# EAGLE board Mainboard (EAGLE 8.7.1), part 1 of 2
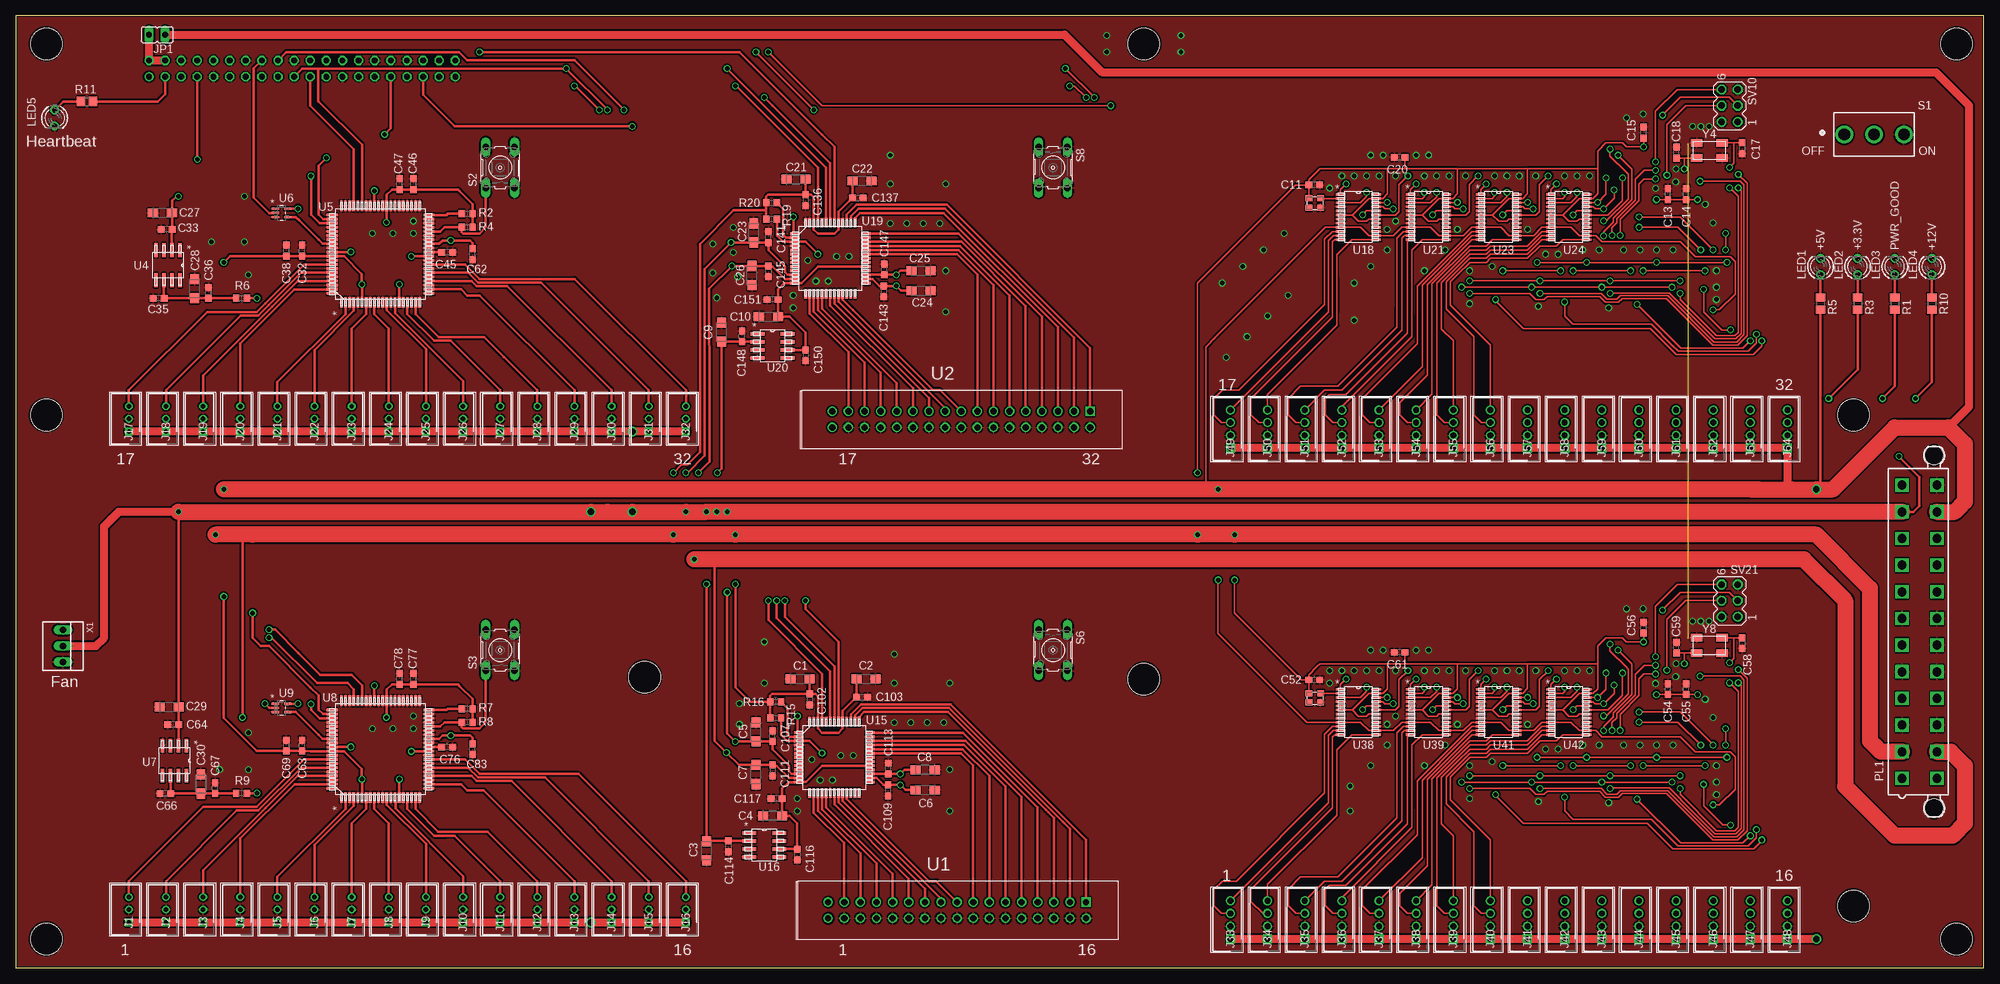
[diagram p11: board, top side]
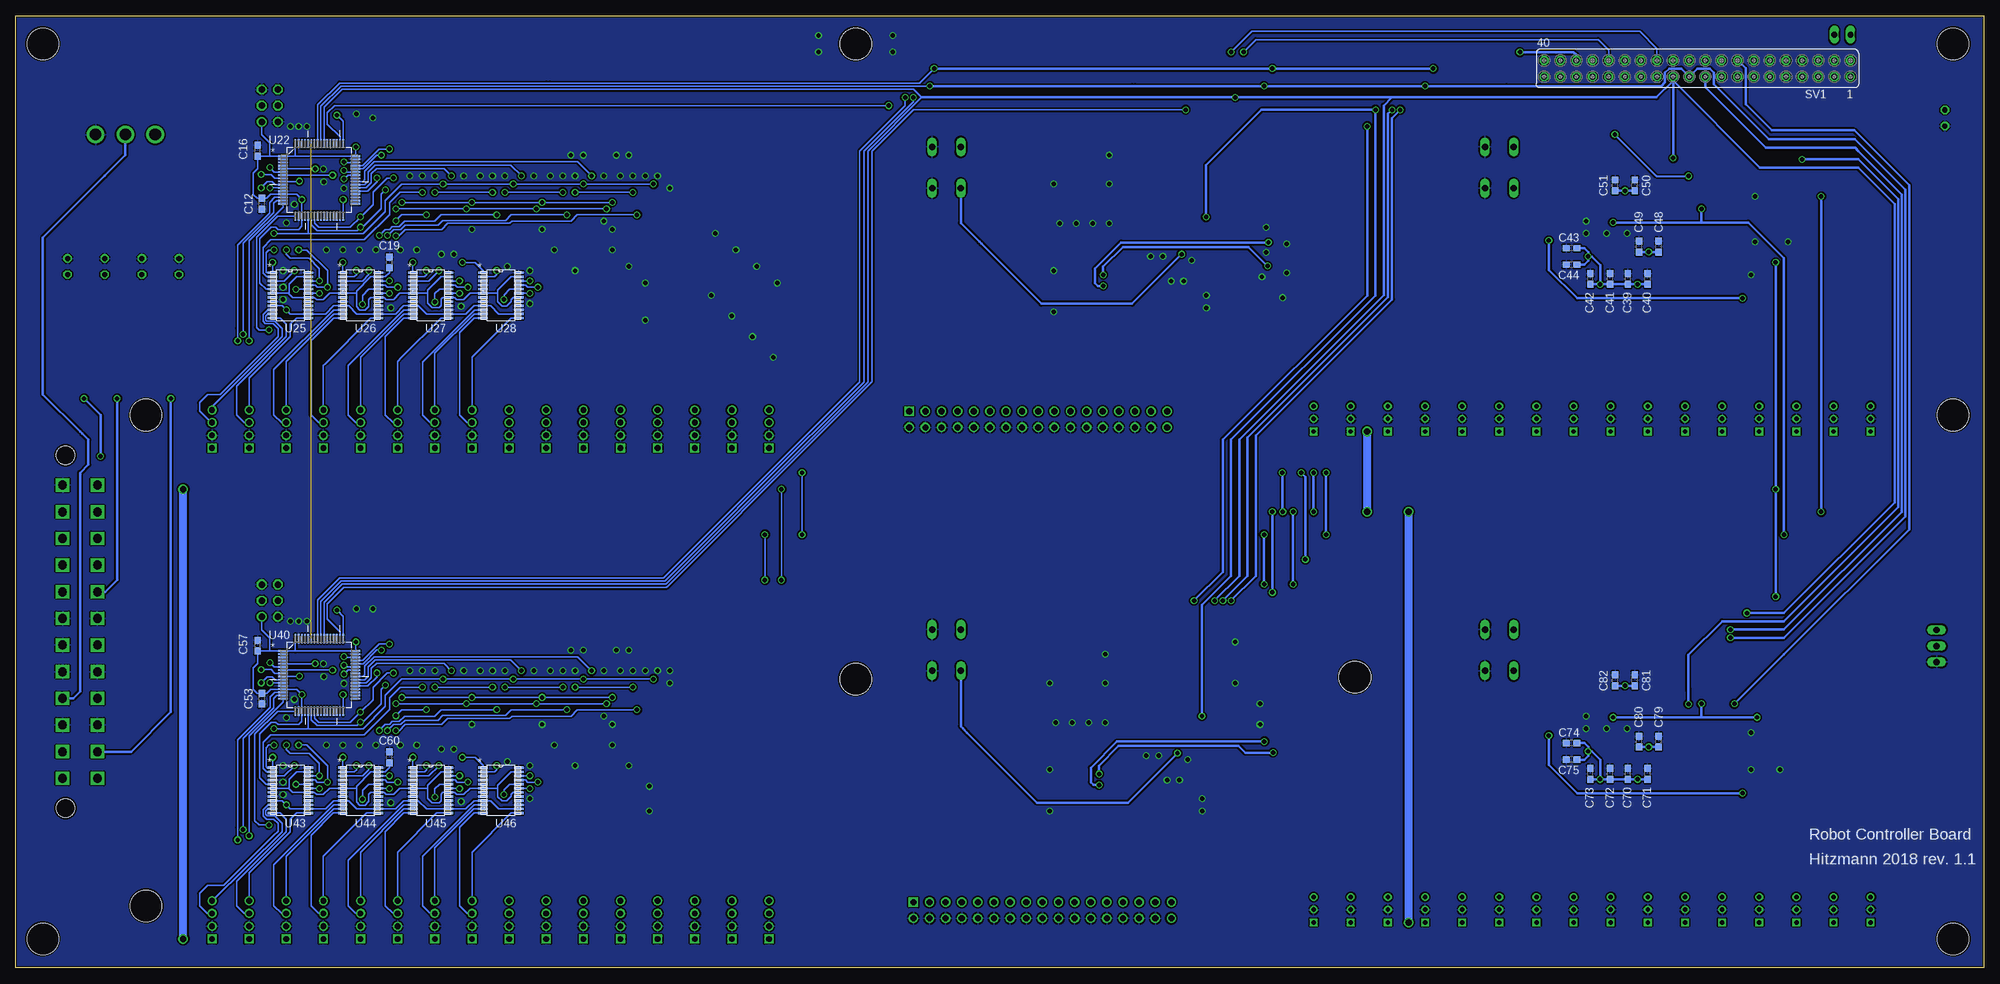
[diagram p12: board, bottom side, seen from below]

Size 310 x 150 mm. Coordinates in mm from the lower left corner, seen from the top.
Outline: 0,0 310,0 310,150 0,150 0,0
Copper layers (1*16): Top 0.035mm / dielectric 1.5mm / Bottom 0.035mm
Design rules "dirt_cheap_dirty_boards.v1.1": minimum track width 6mil, minimum drill 12mil, track to track 6mil, track to pad 6mil, pad to pad 6mil, via to via 6mil, smd to smd 0mil, copper to edge 10mil, drill to drill 10mil, minimum pad ring 10mil, minimum via ring 6mil, stop-mask expansion 2mil, vias tented up to drill 25mil, thermal gap 10mil
Holes 5 mm at 289.5,87.1 289.5,9.75 305.75,145.6 305.75,4.55 4.8,4.55 4.8,145.6 177.7,145.6 4.8,87.1 177.7,45.5 99.05,45.8

## Footprints (pad centres in the part's own frame; a part is rotated, then mirrored left to right if it is on the bottom)
SMC_A = smd 1.6 x 1.4: + -1.5,0; - 1.5,0
C0603 = smd 1.1 x 1: 1 -0.85,0; 2 0.85,0
JST_PH_SHDR3W50P0X200_1X3_790X450X600 = drill 0.7 pad 1.1 square: 1 0,0 | drill 0.7 pad 1.1: 2 2,0; 3 4,0
SHDR4W50P0X200_1X4_990X450X600 = drill 0.9 pad 1.35 square: 1 0,0 | drill 0.9 pad 1.35: 2 2,0; 3 4,0; 4 6,0
JP1 = drill 0.914 long: 1 0,-1.27; 2 0,1.27
LED3MM = drill 0.813 octagon: A -1.27,0; K 1.27,0
5566-24 = drill 1.4 square: 1 23.1,-2.75; 2 18.9,-2.75; 3 14.7,-2.75; 4 10.5,-2.75; 5 6.3,-2.75; 6 2.1,-2.75; 7 -2.1,-2.75; 8 -6.3,-2.75; 9 -10.5,-2.75; 10 -14.7,-2.75; 11 -18.9,-2.75; 12 -23.1,-2.75; 13 23.1,2.75; 14 18.9,2.75; 15 14.7,2.75; 16 10.5,2.75; 17 6.3,2.75; 18 2.1,2.75; 19 -2.1,2.75; 20 -6.3,2.75; 21 -10.5,2.75; 22 -14.7,2.75; 23 -18.9,2.75; 24 -23.1,2.75 | hole 3: 27.8,2.29; -27.8,2.29
R0805 = smd 1.3 x 1.5: 1 -0.95,0; 2 0.95,0
R0603 = smd 1 x 1.1: 1 -0.85,0; 2 0.85,0
1MS1T1B1M2QES-5 = drill 1.85 pad 2.8: 1 0,-4.7; 2 0,0; 3 0,4.7
B3F-10XX = drill 1.016 long: 1 -3.251,2.261; 2 3.251,2.261; 3 -3.251,-2.261; 4 3.251,-2.261
FE20-2 = drill 0.914: 1 -24.13,1.27 | drill 0.914 octagon: 2 -24.13,-1.27; 3 -21.59,1.27; 4 -21.59,-1.27; 5 -19.05,1.27; 6 -19.05,-1.27; 7 -16.51,1.27; 8 -16.51,-1.27; 9 -13.97,1.27; 10 -13.97,-1.27; 11 -11.43,1.27; 12 -11.43,-1.27; 13 -8.89,1.27; 14 -8.89,-1.27; 15 -6.35,1.27; 16 -6.35,-1.27; 17 -3.81,1.27; 18 -3.81,-1.27; 19 -1.27,1.27; 20 -1.27,-1.27; 21 1.27,1.27; 22 1.27,-1.27; 23 3.81,1.27; 24 3.81,-1.27; 25 6.35,1.27; 26 6.35,-1.27; 27 8.89,1.27; 28 8.89,-1.27; 29 11.43,1.27; 30 11.43,-1.27; 31 13.97,1.27; 32 13.97,-1.27; 33 16.51,1.27; 34 16.51,-1.27; 35 19.05,1.27; 36 19.05,-1.27; 37 21.59,1.27; 38 21.59,-1.27; 39 24.13,1.27; 40 24.13,-1.27
MA03-2 = drill 1.016: 1 -2.54,-1.27 | drill 1.016 octagon: 2 -2.54,1.27; 3 0,-1.27; 4 0,1.27; 5 2.54,-1.27; 6 2.54,1.27
AMP-5103309-7-34PIN_TYCO_5103309-7 = drill 0.965 square: 1 0,2.54 | drill 0.965: 2 0,0; 3 -2.54,2.54; 4 -2.54,0; 5 -5.08,2.54; 6 -5.08,0; 7 -7.62,2.54; 8 -7.62,0; 9 -10.16,2.54; 10 -10.16,0; 11 -12.7,2.54; 12 -12.7,0; 13 -15.24,2.54; 14 -15.24,0; 15 -17.78,2.54; 16 -17.78,0; 17 -20.32,2.54; 18 -20.32,0; 19 -22.86,2.54; 20 -22.86,0; 21 -25.4,2.54; 22 -25.4,0; 23 -27.94,2.54; 24 -27.94,0; 25 -30.48,2.54; 26 -30.48,0; 27 -33.02,2.54; 28 -33.02,0; 29 -35.56,2.54; 30 -35.56,0; 31 -38.1,2.54; 32 -38.1,0; 33 -40.64,2.54; 34 -40.64,0
R_8 = smd 2.184 x 0.559: 1 -2.362,1.905; 2 -2.362,0.635; 3 -2.362,-0.635; 4 -2.362,-1.905; 5 2.362,-1.905; 6 2.362,-0.635; 7 2.362,0.635; 8 2.362,1.905
ST_80_2 = smd 1.676 x 0.432: 1 -7.62,6.175; 2 -7.62,5.525; 3 -7.62,4.875; 4 -7.62,4.225; 5 -7.62,3.575; 6 -7.62,2.925; 7 -7.62,2.275; 8 -7.62,1.625; 9 -7.62,0.975; 10 -7.62,0.325; 11 -7.62,-0.325; 12 -7.62,-0.975; 13 -7.62,-1.625; 14 -7.62,-2.275; 15 -7.62,-2.925; 16 -7.62,-3.575; 17 -7.62,-4.225; 18 -7.62,-4.875; 19 -7.62,-5.525; 20 -7.62,-6.175; 41 7.62,-6.175; 42 7.62,-5.525; 43 7.62,-4.875; 44 7.62,-4.225; 45 7.62,-3.575; 46 7.62,-2.925; 47 7.62,-2.275; 48 7.62,-1.625; 49 7.62,-0.975; 50 7.62,-0.325; 51 7.62,0.325; 52 7.62,0.975; 53 7.62,1.625; 54 7.62,2.275; 55 7.62,2.925; 56 7.62,3.575; 57 7.62,4.225; 58 7.62,4.875; 59 7.62,5.525; 60 7.62,6.175 | smd 0.432 x 1.676: 21 -6.175,-7.62; 22 -5.525,-7.62; 23 -4.875,-7.62; 24 -4.225,-7.62; 25 -3.575,-7.62; 26 -2.925,-7.62; 27 -2.275,-7.62; 28 -1.625,-7.62; 29 -0.975,-7.62; 30 -0.325,-7.62; 31 0.325,-7.62; 32 0.975,-7.62; 33 1.625,-7.62; 34 2.275,-7.62; 35 2.925,-7.62; 36 3.575,-7.62; 37 4.225,-7.62; 38 4.875,-7.62; 39 5.525,-7.62; 40 6.175,-7.62; 61 6.175,7.62; 62 5.525,7.62; 63 4.875,7.62; 64 4.225,7.62; 65 3.575,7.62; 66 2.925,7.62; 67 2.275,7.62; 68 1.625,7.62; 69 0.975,7.62; 70 0.325,7.62; 71 -0.325,7.62; 72 -0.975,7.62; 73 -1.625,7.62; 74 -2.275,7.62; 75 -2.925,7.62; 76 -3.575,7.62; 77 -4.225,7.62; 78 -4.875,7.62; 79 -5.525,7.62; 80 -6.175,7.62
SOT65P210X110-5N = smd 1.168 x 0.356: 1 -0.965,0.66; 2 -0.965,0; 3 -0.965,-0.66; 4 0.965,-0.66; 5 0.965,0.66
ST_52 = smd 1.473 x 0.432: 1 -5.613,3.9; 2 -5.613,3.25; 3 -5.613,2.6; 4 -5.613,1.95; 5 -5.613,1.3; 6 -5.613,0.65; 7 -5.613,0; 8 -5.613,-0.65; 9 -5.613,-1.3; 10 -5.613,-1.95; 11 -5.613,-2.6; 12 -5.613,-3.25; 13 -5.613,-3.9; 27 5.613,-3.9; 28 5.613,-3.25; 29 5.613,-2.6; 30 5.613,-1.95; 31 5.613,-1.3; 32 5.613,-0.65; 33 5.613,0; 34 5.613,0.65; 35 5.613,1.3; 36 5.613,1.95; 37 5.613,2.6; 38 5.613,3.25; 39 5.613,3.9 | smd 0.432 x 1.473: 14 -3.9,-5.613; 15 -3.25,-5.613; 16 -2.6,-5.613; 17 -1.95,-5.613; 18 -1.3,-5.613; 19 -0.65,-5.613; 20 0,-5.613; 21 0.65,-5.613; 22 1.3,-5.613; 23 1.95,-5.613; 24 2.6,-5.613; 25 3.25,-5.613; 26 3.9,-5.613; 40 3.9,5.613; 41 3.25,5.613; 42 2.6,5.613; 43 1.95,5.613; 44 1.3,5.613; 45 0.65,5.613; 46 0,5.613; 47 -0.65,5.613; 48 -1.3,5.613; 49 -1.95,5.613; 50 -2.6,5.613; 51 -3.25,5.613; 52 -3.9,5.613
RU_24 = smd 1.473 x 0.356: 1 -2.819,3.575; 2 -2.819,2.925; 3 -2.819,2.275; 4 -2.819,1.625; 5 -2.819,0.975; 6 -2.819,0.325; 7 -2.819,-0.325; 8 -2.819,-0.975; 9 -2.819,-1.625; 10 -2.819,-2.275; 11 -2.819,-2.925; 12 -2.819,-3.575; 13 2.819,-3.575; 14 2.819,-2.925; 15 2.819,-2.275; 16 2.819,-1.625; 17 2.819,-0.975; 18 2.819,-0.325; 19 2.819,0.325; 20 2.819,0.975; 21 2.819,1.625; 22 2.819,2.275; 23 2.819,2.925; 24 2.819,3.575
QFP50P1200X1200X160-64N = smd 1.473 x 0.279: 1 -5.715,3.759; 2 -5.715,3.251; 3 -5.715,2.743; 4 -5.715,2.261; 5 -5.715,1.753; 6 -5.715,1.245; 7 -5.715,0.762; 8 -5.715,0.254; 9 -5.715,-0.254; 10 -5.715,-0.762; 11 -5.715,-1.245; 12 -5.715,-1.753; 13 -5.715,-2.261; 14 -5.715,-2.743; 15 -5.715,-3.251; 16 -5.715,-3.759; 33 5.715,-3.759; 34 5.715,-3.251; 35 5.715,-2.743; 36 5.715,-2.261; 37 5.715,-1.753; 38 5.715,-1.245; 39 5.715,-0.762; 40 5.715,-0.254; 41 5.715,0.254; 42 5.715,0.762; 43 5.715,1.245; 44 5.715,1.753; 45 5.715,2.261; 46 5.715,2.743; 47 5.715,3.251; 48 5.715,3.759 | smd 0.279 x 1.473: 17 -3.759,-5.715; 18 -3.251,-5.715; 19 -2.743,-5.715; 20 -2.261,-5.715; 21 -1.753,-5.715; 22 -1.245,-5.715; 23 -0.762,-5.715; 24 -0.254,-5.715; 25 0.254,-5.715; 26 0.762,-5.715; 27 1.245,-5.715; 28 1.753,-5.715; 29 2.261,-5.715; 30 2.743,-5.715; 31 3.251,-5.715; 32 3.759,-5.715; 49 3.759,5.715; 50 3.251,5.715; 51 2.743,5.715; 52 2.261,5.715; 53 1.753,5.715; 54 1.245,5.715; 55 0.762,5.715; 56 0.254,5.715; 57 -0.254,5.715; 58 -0.762,5.715; 59 -1.245,5.715; 60 -1.753,5.715; 61 -2.261,5.715; 62 -2.743,5.715; 63 -3.251,5.715; 64 -3.759,5.715
22-23-2031 = drill 1 long: 1 -2.54,0; 2 0,0; 3 2.54,0
KC2520B-C1 = smd 1.05 x 0.95: 1 0,-1.45; 2 1.85,-1.45; 3 1.85,0; 4 0,0
ABM3B = smd 1.8 x 1.2: 1 0,-2.4; 2 4,-2.4; 3 4,0; 4 0,0

## Placement (x,y rotation side)
C1  10uF  [SMC_A]  123.55,45.5 180 top
C2  10uF  [SMC_A]  133.95,45.5 0 top
C3  10uF  [SMC_A]  108.8,18.45 270 top
C4  10uF  [SMC_A]  119.2,23.95 180 top
C5  10uF  [SMC_A]  116.6,37.15 90 top
C6  10uF  [SMC_A]  143.25,28 0 top
C7  10uF  [SMC_A]  116.6,30.45 90 top
C8  10uF  [SMC_A]  143.25,31.2 180 top
C9  10uF  [SMC_A]  111.15,100.15 90 top
C10  10uF  [SMC_A]  118.55,102.6 180 top
C11  100nF  [C0603]  204.55,123.35 180 top
C12  100nF  [C0603]  271.25,120.4 90 bottom
C13  100nF  [C0603]  260.25,121.9 90 top
C14  100nF  [C0603]  263.15,121.9 90 top
C15  100nF  [C0603]  256.45,131.6 90 top
C16  100nF  [C0603]  271.9,128.75 90 bottom
C17  33pf  [C0603]  271.95,129.15 270 top
C18  33pf  [C0603]  261.6,128.45 90 top
C19  100nF  [C0603]  251.15,111.15 90 bottom
C20  100nF  [C0603]  218,127.7 180 top
C21  10uF  [SMC_A]  122.9,124.25 180 top
C22  10uF  [SMC_A]  133.3,124 0 top
C23  10uF  [SMC_A]  116.25,115.8 90 top
C24  10uF  [SMC_A]  142.6,106.7 0 top
C25  10uF  [SMC_A]  142.6,109.85 180 top
C26  10uF  [SMC_A]  115.95,109.1 90 top
C27  10uF  [SMC_A]  23.1,118.95 180 top
C28  10uF  [SMC_A]  28.15,107 90 top
C29  10uF  [SMC_A]  24.15,41.1 180 top
C30  10uF  [SMC_A]  29.15,28.95 90 top
C32  100nF  [C0603]  45.1,113 90 top
C33  100nF  [C0603]  23.75,116.35 180 top
C35  100nF  [C0603]  22.5,105.5 180 top
C36  100nF  [C0603]  30.35,106.35 90 top
C38  10uF  [C0603]  42.6,113 90 top
C39  100nF  [C0603]  56.05,108.55 90 bottom
C40  10uF  [C0603]  52.95,108.55 90 bottom
C41  100nF  [C0603]  58.85,108.55 90 bottom
C42  10uF  [C0603]  61.95,108.55 90 bottom
C43  100nF  [C0603]  64.9,113.4 180 bottom
C44  10uF  [C0603]  64.9,110.8 180 bottom
C45  10uF  [C0603]  67.95,112.75 180 top
C46  100nF  [C0603]  62.65,123.5 90 top
C47  10uF  [C0603]  60.45,123.5 90 top
C48  100nF  [C0603]  51.2,113.65 90 bottom
C49  10uF  [C0603]  54.3,113.65 90 bottom
C50  10uF  [C0603]  54.95,123.3 90 bottom
C51  100nF  [C0603]  58.05,123.3 90 bottom
C52  100nF  [C0603]  204.55,45.35 180 top
C53  100nF  [C0603]  271.25,42.4 90 bottom
C54  100nF  [C0603]  260.25,43.9 90 top
C55  100nF  [C0603]  263.15,43.9 90 top
C56  100nF  [C0603]  256.45,53.6 90 top
C57  100nF  [C0603]  271.9,50.75 90 bottom
C58  33pf  [C0603]  271.95,51.15 270 top
C59  33pf  [C0603]  261.6,50.45 90 top
C60  100nF  [C0603]  251.15,33.15 90 bottom
C61  100nF  [C0603]  218,49.7 180 top
C62  100nF  [C0603]  71.95,112.45 90 top
C63  100nF  [C0603]  45.1,35 90 top
C64  100nF  [C0603]  24.8,38.3 180 top
C66  100nF  [C0603]  23.55,27.45 180 top
C67  100nF  [C0603]  31.4,28.3 90 top
C69  10uF  [C0603]  42.6,35 90 top
C70  100nF  [C0603]  56.05,30.55 90 bottom
C71  10uF  [C0603]  52.95,30.55 90 bottom
C72  100nF  [C0603]  58.85,30.55 90 bottom
C73  10uF  [C0603]  61.95,30.55 90 bottom
C74  100nF  [C0603]  64.9,35.4 180 bottom
C75  10uF  [C0603]  64.9,32.8 180 bottom
C76  10uF  [C0603]  67.95,34.75 180 top
C77  100nF  [C0603]  62.65,45.5 90 top
C78  10uF  [C0603]  60.45,45.5 90 top
C79  100nF  [C0603]  51.2,35.65 90 bottom
C80  10uF  [C0603]  54.3,35.65 90 bottom
C81  10uF  [C0603]  54.95,45.3 90 bottom
C82  100nF  [C0603]  58.05,45.3 90 bottom
C83  100nF  [C0603]  71.95,34.45 90 top
C102  100nF  [C0603]  125.05,42.3 270 top
C103  100nF  [C0603]  133.3,42.65 0 top
C107  100nF  [C0603]  119.2,36.5 90 top
C109  100nF  [C0603]  137.4,27.95 270 top
C111  100nF  [C0603]  119.2,31.1 270 top
C113  100nF  [C0603]  137.45,31.4 90 top
C114  100nF  [C0603]  112.25,19.15 270 top
C116  100nF  [C0603]  123.1,17.85 270 top
C117  100nF  [C0603]  119.85,26.65 180 top
C136  100nF  [C0603]  124.4,120.95 270 top
C137  100nF  [C0603]  132.65,121.3 0 top
C141  100nF  [C0603]  118.55,115.15 90 top
C143  100nF  [C0603]  136.75,106.6 270 top
C145  100nF  [C0603]  118.55,109.75 270 top
C147  100nF  [C0603]  136.8,110.05 90 top
C148  100nF  [C0603]  114.4,99.5 90 top
C150  100nF  [C0603]  124.4,96.5 270 top
C151  100nF  [C0603]  119.2,105.3 180 top
J1  JST_PH_B3B-PH-K-S(LF)(SN)  [JST_PH_SHDR3W50P0X200_1X3_790X450X600]  17.8,7.15 90 top
J2  JST_PH_B3B-PH-K-S(LF)(SN)  [JST_PH_SHDR3W50P0X200_1X3_790X450X600]  23.65,7.15 90 top
J3  JST_PH_B3B-PH-K-S(LF)(SN)  [JST_PH_SHDR3W50P0X200_1X3_790X450X600]  29.5,7.15 90 top
J4  JST_PH_B3B-PH-K-S(LF)(SN)  [JST_PH_SHDR3W50P0X200_1X3_790X450X600]  35.35,7.15 90 top
J5  JST_PH_B3B-PH-K-S(LF)(SN)  [JST_PH_SHDR3W50P0X200_1X3_790X450X600]  41.2,7.15 90 top
J6  JST_PH_B3B-PH-K-S(LF)(SN)  [JST_PH_SHDR3W50P0X200_1X3_790X450X600]  47.05,7.15 90 top
J7  JST_PH_B3B-PH-K-S(LF)(SN)  [JST_PH_SHDR3W50P0X200_1X3_790X450X600]  52.9,7.15 90 top
J8  JST_PH_B3B-PH-K-S(LF)(SN)  [JST_PH_SHDR3W50P0X200_1X3_790X450X600]  58.75,7.15 90 top
J9  JST_PH_B3B-PH-K-S(LF)(SN)  [JST_PH_SHDR3W50P0X200_1X3_790X450X600]  64.6,7.15 90 top
J10  JST_PH_B3B-PH-K-S(LF)(SN)  [JST_PH_SHDR3W50P0X200_1X3_790X450X600]  70.45,7.15 90 top
J11  JST_PH_B3B-PH-K-S(LF)(SN)  [JST_PH_SHDR3W50P0X200_1X3_790X450X600]  76.3,7.15 90 top
J12  JST_PH_B3B-PH-K-S(LF)(SN)  [JST_PH_SHDR3W50P0X200_1X3_790X450X600]  82.15,7.15 90 top
J13  JST_PH_B3B-PH-K-S(LF)(SN)  [JST_PH_SHDR3W50P0X200_1X3_790X450X600]  88,7.15 90 top
J14  JST_PH_B3B-PH-K-S(LF)(SN)  [JST_PH_SHDR3W50P0X200_1X3_790X450X600]  93.85,7.15 90 top
J15  JST_PH_B3B-PH-K-S(LF)(SN)  [JST_PH_SHDR3W50P0X200_1X3_790X450X600]  99.7,7.15 90 top
J16  JST_PH_B3B-PH-K-S(LF)(SN)  [JST_PH_SHDR3W50P0X200_1X3_790X450X600]  105.55,7.15 90 top
J17  JST_PH_B3B-PH-K-S(LF)(SN)  [JST_PH_SHDR3W50P0X200_1X3_790X450X600]  17.8,84.5 90 top
J18  JST_PH_B3B-PH-K-S(LF)(SN)  [JST_PH_SHDR3W50P0X200_1X3_790X450X600]  23.65,84.5 90 top
J19  JST_PH_B3B-PH-K-S(LF)(SN)  [JST_PH_SHDR3W50P0X200_1X3_790X450X600]  29.5,84.5 90 top
J20  JST_PH_B3B-PH-K-S(LF)(SN)  [JST_PH_SHDR3W50P0X200_1X3_790X450X600]  35.35,84.5 90 top
J21  JST_PH_B3B-PH-K-S(LF)(SN)  [JST_PH_SHDR3W50P0X200_1X3_790X450X600]  41.2,84.5 90 top
J22  JST_PH_B3B-PH-K-S(LF)(SN)  [JST_PH_SHDR3W50P0X200_1X3_790X450X600]  47.05,84.5 90 top
J23  JST_PH_B3B-PH-K-S(LF)(SN)  [JST_PH_SHDR3W50P0X200_1X3_790X450X600]  52.9,84.5 90 top
J24  JST_PH_B3B-PH-K-S(LF)(SN)  [JST_PH_SHDR3W50P0X200_1X3_790X450X600]  58.75,84.5 90 top
J25  JST_PH_B3B-PH-K-S(LF)(SN)  [JST_PH_SHDR3W50P0X200_1X3_790X450X600]  64.6,84.5 90 top
J26  JST_PH_B3B-PH-K-S(LF)(SN)  [JST_PH_SHDR3W50P0X200_1X3_790X450X600]  70.45,84.5 90 top
J27  JST_PH_B3B-PH-K-S(LF)(SN)  [JST_PH_SHDR3W50P0X200_1X3_790X450X600]  76.3,84.5 90 top
J28  JST_PH_B3B-PH-K-S(LF)(SN)  [JST_PH_SHDR3W50P0X200_1X3_790X450X600]  82.15,84.5 90 top
J29  JST_PH_B3B-PH-K-S(LF)(SN)  [JST_PH_SHDR3W50P0X200_1X3_790X450X600]  88,84.5 90 top
J30  JST_PH_B3B-PH-K-S(LF)(SN)  [JST_PH_SHDR3W50P0X200_1X3_790X450X600]  93.85,84.5 90 top
J31  JST_PH_B3B-PH-K-S(LF)(SN)  [JST_PH_SHDR3W50P0X200_1X3_790X450X600]  99.7,84.5 90 top
J32  JST_PH_B3B-PH-K-S(LF)(SN)  [JST_PH_SHDR3W50P0X200_1X3_790X450X600]  105.55,84.5 90 top
J33  [SHDR4W50P0X200_1X4_990X450X600]  191.35,4.55 90 top
J34  [SHDR4W50P0X200_1X4_990X450X600]  197.2,4.55 90 top
J35  [SHDR4W50P0X200_1X4_990X450X600]  203.05,4.55 90 top
J36  [SHDR4W50P0X200_1X4_990X450X600]  208.9,4.55 90 top
J37  [SHDR4W50P0X200_1X4_990X450X600]  214.75,4.55 90 top
J38  [SHDR4W50P0X200_1X4_990X450X600]  220.6,4.55 90 top
J39  [SHDR4W50P0X200_1X4_990X450X600]  226.45,4.55 90 top
J40  [SHDR4W50P0X200_1X4_990X450X600]  232.3,4.55 90 top
J41  [SHDR4W50P0X200_1X4_990X450X600]  238.15,4.55 90 top
J42  [SHDR4W50P0X200_1X4_990X450X600]  244,4.55 90 top
J43  [SHDR4W50P0X200_1X4_990X450X600]  249.85,4.55 90 top
J44  [SHDR4W50P0X200_1X4_990X450X600]  255.7,4.55 90 top
J45  [SHDR4W50P0X200_1X4_990X450X600]  261.55,4.55 90 top
J46  [SHDR4W50P0X200_1X4_990X450X600]  267.4,4.55 90 top
J47  [SHDR4W50P0X200_1X4_990X450X600]  273.25,4.55 90 top
J48  [SHDR4W50P0X200_1X4_990X450X600]  279.1,4.55 90 top
J49  [SHDR4W50P0X200_1X4_990X450X600]  191.35,81.9 90 top
J50  [SHDR4W50P0X200_1X4_990X450X600]  197.2,81.9 90 top
J51  [SHDR4W50P0X200_1X4_990X450X600]  203.05,81.9 90 top
J52  [SHDR4W50P0X200_1X4_990X450X600]  208.9,81.9 90 top
J53  [SHDR4W50P0X200_1X4_990X450X600]  214.75,81.9 90 top
J54  [SHDR4W50P0X200_1X4_990X450X600]  220.6,81.9 90 top
J55  [SHDR4W50P0X200_1X4_990X450X600]  226.45,81.9 90 top
J56  [SHDR4W50P0X200_1X4_990X450X600]  232.3,81.9 90 top
J57  [SHDR4W50P0X200_1X4_990X450X600]  238.15,81.9 90 top
J58  [SHDR4W50P0X200_1X4_990X450X600]  244,81.9 90 top
J59  [SHDR4W50P0X200_1X4_990X450X600]  249.85,81.9 90 top
J60  [SHDR4W50P0X200_1X4_990X450X600]  255.7,81.9 90 top
J61  [SHDR4W50P0X200_1X4_990X450X600]  261.55,81.9 90 top
J62  [SHDR4W50P0X200_1X4_990X450X600]  267.4,81.9 90 top
J63  [SHDR4W50P0X200_1X4_990X450X600]  273.25,81.9 90 top
J64  [SHDR4W50P0X200_1X4_990X450X600]  279.1,81.9 90 top
JP1  [JP1]  22.25,147.05 90 top
LED1  [LED3MM]  284.3,110.5 90 top
LED2  [LED3MM]  290.15,110.5 90 top
LED3  [LED3MM]  296,110.5 90 top
LED4  [LED3MM]  301.85,110.5 90 top
LED5  [LED3MM]  6.1,133.9 270 top
PL1  [5566-24]  299.9,52.95 270 top
R1  220  [R0805]  296,104.65 270 top
R2  10k  [R0603]  71.1,118.8 0 top
R3  68  [R0805]  290.15,104.65 270 top
R4  10k  [R0603]  71.1,116.7 0 top
R5  220  [R0805]  284.3,104.65 270 top
R6  10k  [R0603]  35.55,105.5 180 top
R7  10k  [R0603]  71.1,40.8 0 top
R8  10k  [R0603]  71.1,38.7 0 top
R9  10k  [R0603]  35.55,27.5 180 top
R10  680  [R0805]  301.85,104.65 270 top
R11  330  [R0805]  11.2,136.5 0 top
R15  100k  [R0603]  119.7,39.35 0 top
R16  100k  [R0603]  119.7,41.9 0 top
R19  100k  [R0603]  119.05,118 0 top
R20  100k  [R0603]  119.05,120.55 0 top
S1  [1MS1T1B1M2QES-5]  292.75,131.3 270 top
S2  [B3F-10XX]  76.3,126.1 90 top
S3  [B3F-10XX]  76.3,50.05 90 top
S6  [B3F-10XX]  163.4,50.05 270 top
S8  [B3F-10XX]  163.4,126.1 270 top
SV1  [FE20-2]  45.1,141.7 180 bottom
SV10  [MA03-2]  270,135.85 90 top
SV21  [MA03-2]  270,57.85 90 top
U1  [AMP-5103309-7-34PIN_TYCO_5103309-7]  168.6,7.8 0 top
U2  [AMP-5103309-7-34PIN_TYCO_5103309-7]  169.25,85.15 0 top
U4  ADR421ARZ  [R_8]  23.95,110.7 270 top
U5  AD7616BSTZ  [ST_80_2]  57.45,112.45 90 top
U6  74AHC1G04GW/T1  [SOT65P210X110-5N]  41.85,118.95 0 top
U7  ADR421ARZ  [R_8]  25,32.65 270 top
U8  AD7616BSTZ  [ST_80_2]  57.45,34.45 90 top
U9  74AHC1G04GW/T1  [SOT65P210X110-5N]  41.85,40.95 0 top
U15  AD5360BSTZ  [ST_52]  128.95,33.15 0 top
U16  ADR425ARZ  [R_8]  117.9,19.35 0 top
U18  AD7730BRUZ  [RU_24]  211.5,118.3 0 top
U19  AD5360BSTZ  [ST_52]  128.3,111.8 0 top
U20  ADR425ARZ  [R_8]  119.2,98 0 top
U21  AD7730BRUZ  [RU_24]  222.55,118.3 0 top
U22  STM32F103RCT6  [QFP50P1200X1200X160-64N]  262.2,124.15 0 bottom
U23  AD7730BRUZ  [RU_24]  233.6,118.3 0 top
U24  AD7730BRUZ  [RU_24]  244.65,118.3 0 top
U25  AD7730BRUZ  [RU_24]  266.75,105.95 0 bottom
U26  AD7730BRUZ  [RU_24]  255.7,105.95 0 bottom
U27  AD7730BRUZ  [RU_24]  244.65,105.95 0 bottom
U28  AD7730BRUZ  [RU_24]  233.6,105.95 0 bottom
U38  AD7730BRUZ  [RU_24]  211.5,40.3 0 top
U39  AD7730BRUZ  [RU_24]  222.55,40.3 0 top
U40  STM32F103RCT6  [QFP50P1200X1200X160-64N]  262.2,46.15 0 bottom
U41  AD7730BRUZ  [RU_24]  233.6,40.3 0 top
U42  AD7730BRUZ  [RU_24]  244.65,40.3 0 top
U43  AD7730BRUZ  [RU_24]  266.75,27.95 0 bottom
U44  AD7730BRUZ  [RU_24]  255.7,27.95 0 bottom
U45  AD7730BRUZ  [RU_24]  244.65,27.95 0 bottom
U46  AD7730BRUZ  [RU_24]  233.6,27.95 0 bottom
X1  22-23-2031  [22-23-2031]  7.4,50.7 270 top
Y3  KC2520B-C1  [KC2520B-C1]  203.7,121.25 0 top
Y4  ABM3B  [ABM3B]  264.8,130 0 top
Y7  KC2520B-C1  [KC2520B-C1]  203.7,43.25 0 top
Y8  ABM3B  [ABM3B]  264.8,52 0 top

## Tracks (layer width: path | path; a pad name or v marks a point on that pad's centre or on a via)
+5V  (via drill 0.7, 1)
  Top 0.254: v267.4,103.67 268.38,103.67 270.85,106.15 270.85,111.27 270.06,112.05 264.55,112.05 262.2,114.4 249.85,114.4 248.88,115.38 U24.14 246.28,115.38 244.97,116.67 U24.9 240.43,116.67 239.12,115.38 U23.14 235.22,115.38 233.93,116.67 U23.9 229.38,116.67 228.07,115.38 U21.14 224.18,115.38 222.88,116.67 U21.9 218.32,116.67 217.03,115.38 U18.14 213.12,115.38 211.82,116.67 U18.9 206.32,116.67 188.93,99.28 | v267.4,25.68 268.38,25.68 270.85,28.15 270.85,33.27 270.06,34.05 264.55,34.05 262.2,36.4 249.85,36.4 248.88,37.38 U42.14 246.28,37.38 244.97,38.67 U42.9 240.43,38.67 239.12,37.38 U41.14 235.22,37.38 233.93,38.67 U41.9 229.38,38.67 228.07,37.38 U39.14 224.18,37.38 222.88,38.67 U39.9 218.32,38.67 217.03,37.38 U38.14 213.12,37.38 211.82,38.67 U38.9 206.32,38.67 203.38,38.67 189.4,52.65 v189.4,61.1 | 188.75,99.1 188.93,99.28 | 188.93,99.28 187.45,97.8 187.45,75.4
  Top 0.406: U5.15 60.38,107.67 v60.4,107.7 | U5.30 62.33,112.12 v62.3,112.1 | U5.6 54.52,107.67 v54.5,107.7 54.5,109.32 51.7,112.12 U5.71 46.42,112.12 C32.1 C38.1 33.75,112.15 v32.75,111.15 | U8.15 60.38,29.68 v60.4,29.7 | U8.30 62.33,34.12 v62.3,34.1 | U8.6 54.52,29.68 v54.5,29.7 54.5,31.32 51.7,34.12 U8.71 46.42,34.12 C63.1 C69.1 37.95,34.15 32.75,39.35 v32.75,58.5 | R5.2 284.3,75.4 v283.65,75.4
  Top 1.27: 279.75,75.4 279.1,76.05 J64.1 J63.1 J62.1 J61.1 J60.1 J59.1 J58.1 J57.1 J56.1 J55.1 J54.1 J53.1 209.55,81.9 | 209.55,81.9 J52.1 | 209.55,81.9 J51.1 J50.1 J49.1 | J33.1 J34.1 J35.1 J36.1 J37.1 J38.1 J39.1 J40.1 J41.1 J42.1 J43.1 J44.1 J45.1 J46.1 J47.1 J48.1 v283.65,4.55 | JP1.1 165.2,147.05 171.2,141.05 302.5,141.05 307.7,135.85 307.7,88.4 304.45,85.15
  Top 2.54: 274.55,75.4 273.25,75.4 | 273.25,75.4 v189.4,75.4 188.75,75.4 187.45,75.4 114.65,75.4 v32.75,75.4 | 273.25,75.4 279.75,75.4 v283.65,75.4 286.25,75.4 296,85.15 304.45,85.15 307.05,82.55 307.05,73.45 305.45,71.85 | PL1.23 305.45,71.85 | 305.45,71.85 306.4,72.8
  Bottom 0.254: 253.75,103.03 U26.14 250.18,103.03 248.88,104.33 U27.9 246.59,104.33 245.29,103.03 U27.14 239.12,103.03 237.82,104.33 U28.9 235.22,104.33 233.93,103.03 U28.14 | 253.75,103.03 253.97,103.03 | U25.9 268.05,104.33 v267.4,103.67 266.75,103.03 266.1,103.03 U25.14 261.23,103.03 259.93,104.33 U26.9 257.57,104.33 256.27,103.03 253.75,103.03 | 266.1,25.02 U43.14 261.23,25.02 259.93,26.32 U44.9 257.57,26.32 256.27,25.02 253.75,25.02 | 266.1,25.02 266.43,25.02 | 253.75,25.02 U44.14 250.18,25.02 248.88,26.32 U45.9 246.59,26.32 245.29,25.02 U45.14 239.12,25.02 237.82,26.32 U46.9 235.22,26.32 233.93,25.02 232.95,25.02 | 253.75,25.02 253.97,25.02 | U46.14 232.95,25.02 | 232.95,25.02 233.28,25.02 | U43.9 268.05,26.32 v267.4,25.68 266.75,25.02 266.1,25.02 | v189.4,61.1 v189.4,75.4
  Bottom 0.406: v60.4,107.7 C41.1 C39.1 v54.5,107.7 C40.1 | C42.1 v60.4,107.7 | v62.3,112.1 61.74,112.1 60.4,110.76 v60.4,107.7 | C44.1 62.9,110.8 62.3,111.4 v62.3,112.1 | C43.1 62.91,113.4 62.3,112.79 v62.3,112.1 | v60.4,29.7 C72.1 C70.1 v54.5,29.7 C71.1 | C73.1 v60.4,29.7 | v62.3,34.1 61.74,34.1 60.4,32.76 v60.4,29.7 | C75.1 62.9,32.8 62.3,33.4 v62.3,34.1 | C74.1 62.91,35.4 62.3,34.79 v62.3,34.1 | v32.75,111.15 v32.75,75.4 v32.75,58.5
  Bottom 1.27: v283.65,4.55 v283.65,75.4
ADC1_0
  Top 0.406: J16.3 105.55,13.65 88.65,30.55 73.7,30.55 73.05,30.55 70.78,32.83 U8.28
ADC1_1
  Top 0.406: J15.3 99.7,13.65 83.36,29.99 72.82,29.99 71.28,31.52 U8.26
ADC1_2
  Top 0.406: J14.3 93.85,13.65 78.07,29.43 72.59,29.43 71.79,30.23 U8.24
ADC1_3
  Top 0.406: J13.3 88,13.65 73.7,27.95 71.1,27.95 70.12,28.93 U8.22
ADC1_4
  Top 0.406: J12.3 82.15,13.65 74.35,21.45 66.55,21.45 62.98,25.02 U8.19
ADC1_5
  Top 0.406: J11.3 76.3,13.65 69.15,20.8 67.85,20.8 | U8.17 61.67,25.02 65.9,20.8 67.85,20.8 | 67.85,20.8 67.2,20.8
ADC1_6
  Top 0.406: J10.3 70.45,14.44 59.8,25.09 59.8,26.75 U8.14
ADC1_7
  Top 0.406: U8.12 58.42,25.68 64.6,19.5 J9.3
ADC1_8
  Top 0.406: J1.3 17.8,13.65 29.5,25.35 37.95,25.35 45.42,32.83 U8.73
ADC1_9
  Top 0.406: J2.3 23.65,13.65 34.79,24.79 38.18,24.79 44.91,31.52 U8.75
ADC1_10
  Top 0.406: J3.3 29.5,15.32 39.39,25.21 44.41,30.23 U8.77
ADC1_11
  Top 0.406: J4.3 35.35,20.38 43.9,28.93 U8.79
ADC1_12
  Top 0.406: U8.2 51.92,25.02 41.2,14.3 J5.3
ADC1_13
  Top 0.406: U8.4 53.23,25.54 47.05,19.36 J6.3
ADC1_14
  Top 0.406: U8.7 55.17,25.02 52.9,22.75 J7.3
ADC1_15
  Top 0.406: U8.9 56.48,25.02 58.75,22.75 J8.3
ADC2_0
  Top 0.406: J32.3 105.55,91 88,108.55 73.05,108.55 70.78,110.83 U5.28
ADC2_1
  Top 0.406: J31.3 99.7,91 82.71,107.99 72.82,107.99 71.28,109.53 U5.26
ADC2_2
  Top 0.406: J30.3 93.85,91 77.42,107.43 72.59,107.43 71.79,108.22 U5.24
ADC2_3
  Top 0.406: J29.3 88,91 73.05,105.95 71.1,105.95 70.12,106.92 U5.22
ADC2_4
  Top 0.406: J28.3 82.15,91 76.95,96.2 | 76.95,96.2 76.88,96.27 | U5.19 62.98,103.03 66.64,99.36 68.5,99.36 | 68.5,99.36 68.73,99.36 | 68.5,99.36 73.79,99.36 76.95,96.2
ADC2_5
  Top 0.406: J27.3 76.3,91 68.5,98.8 65.9,98.8 61.67,103.03 U5.17
ADC2_6
  Top 0.406: U5.14 59.73,103.17 70.45,92.44 J26.3
ADC2_7
  Top 0.406: U5.12 58.42,103.67 64.6,97.5 J25.3
ADC2_8
  Top 0.406: J17.3 17.8,91 30.15,103.35 37.95,103.35 39.25,104.65 45.42,110.83 U5.73
ADC2_9
  Top 0.406: J18.3 23.65,91 35.44,102.79 38.18,102.79 39.81,104.42 44.91,109.53 U5.75
ADC2_10
  Top 0.406: J19.3 29.5,93.32 40.37,104.19 44.41,108.22 U5.77
ADC2_11
  Top 0.406: J20.3 35.35,98.38 43.82,106.85 49.75,106.85 U5.79
ADC2_12
  Top 0.406: U5.2 51.92,103.03 41.2,92.3 J21.3
ADC2_13
  Top 0.406: J22.3 47.05,97.36 53.23,103.53 U5.4
ADC2_14
  Top 0.406: U5.7 55.17,103.03 52.9,100.75 J23.3
ADC2_15
  Top 0.406: U5.9 56.48,103.03 58.75,100.75 J24.3
ADC_1_VREF
  Top 0.406: U4.6 23.31,105.53 C35.1 C28.+ C36.1 R6.2
ADC_2_VREF
  Top 0.406: U7.6 24.37,27.48 C66.1 C30.+ C67.1 34.65,27.45 R9.2
BT2_1_AIN1_+
  Top 0.254: U38.10 207.42,38.02 206.19,36.79 206.19,27.59 192.25,13.65 190.05,13.65 188.75,12.35 188.75,9.75 189.95,8.55 J33.3
BT2_1_AIN1_-
  Top 0.254: U38.11 207.57,37.38 206.79,36.59 206.79,25.99 J33.4
BT2_1_AIN2_+
  Top 0.254: U38.12 207.76,36.73 207.44,36.41 207.44,25.2 194.6,12.35 194.6,10.4 196.45,8.55 J34.3
BT2_1_AIN2_-
  Top 0.254: U38.13 210.51,36.73 208.12,34.34 208.12,24.05 197.2,13.13 J34.4
BT2_1_MCLK_OUT  (via drill 0.7)
  Top 0.254: U38.3 211.82,42.58 212.8,43.55 v212.8,44.2 | v221.9,44.2 221.9,43.55 221.57,43.23 U39.2
  Bottom 0.254: v212.8,44.2 v221.9,44.2
BT2_2_AIN1_+
  Top 0.254: U39.10 218.58,38.02 217.56,37.01 217.56,23.61 208.25,14.3 202.4,14.3 200.45,12.35 200.45,9.75 201.65,8.55 J35.3
BT2_2_AIN1_-
  Top 0.254: U39.11 218.76,37.38 218.39,37 218.39,23.14 208.9,13.65 206.15,13.65 J35.4
BT2_2_AIN2_+
  Top 0.254: U39.12 219.71,36.75 219.15,36.75 219.2,36.7 219.2,22.65 209.55,13 206.95,13 206.3,12.35 206.3,9.75 207.5,8.55 J36.3
BT2_2_AIN2_-
  Top 0.254: U39.13 221.57,36.73 219.96,35.11 219.96,22.11 208.9,11.05 J36.4
BT2_2_MCLK_OUT  (via drill 0.7)
  Top 0.254: U39.3 222.88,42.58 223.85,43.55 v223.85,44.2 | v232.95,44.2 232.95,43.6 232.57,43.23 U41.2
  Bottom 0.254: v223.85,44.2 v232.95,44.2
BT2_3_AIN1_+
  Top 0.254: U41.10 229.38,38.02 220.78,29.43 220.78,25.35 | 220.78,25.35 220.78,25.17 | 220.78,25.35 220.78,20.98 212.15,12.35 212.15,9.75 213.35,8.55 J37.3
BT2_3_AIN1_-
  Top 0.254: U41.11 229.38,37.38 227.1,35.1 221.55,29.55 221.55,17.35 J37.4
BT2_3_AIN2_+
  Top 0.254: U41.12 229.38,36.73 222.34,29.69 222.34,16.04 218,11.7 218,9.75 219.2,8.55 J38.3
BT2_3_AIN2_-
  Top 0.254: U41.13 232.62,36.73 231.65,35.75 229.05,35.75 223.09,29.79 223.09,13.04 J38.4
BT2_3_MCLK_OUT  (via drill 0.7)
  Top 0.254: U41.3 233.93,42.58 234.9,43.55 v234.9,44.2 | v244,44.2 244,43.55 243.68,43.23 U42.2
  Bottom 0.254: v234.9,44.2 v244,44.2
BT2_4_AIN1_+
  Top 0.254: U42.10 240.43,38.02 238.15,35.75 232.3,35.75 231.65,35.1 229.05,35.1 227.1,33.15 223.85,29.9 223.85,9.75 225.05,8.55 J39.3
BT2_4_AIN1_-
  Top 0.254: U42.11 240.43,37.38 238.15,35.1 232.3,35.1 231.65,34.45 229.05,34.45 227.1,32.5 224.58,29.98 224.58,22.67 226.45,20.8 J39.4
BT2_4_AIN2_+
  Top 0.254: U42.12 240.43,36.73 238.15,34.45 232.3,34.45 231.65,33.8 229.05,33.8 227.1,31.85 225.35,30.1 225.35,25.8 229.7,21.45 229.7,9.75 230.9,8.55 | J40.3 231,8.55 | 231,8.55 230.9,8.55 | 231,8.55 230.9,8.55
BT2_4_AIN2_-
  Top 0.254: U42.13 243.68,36.73 242.7,35.75 240.1,35.75 238.15,33.8 232.3,33.8 231.65,33.15 229.05,33.15 227.1,31.2 226,30.11 226,26.45 232.3,20.15 J40.4
BT2_4_MCLK_OUT  (via drill 0.7)
  Top 0.254: U42.3 244.97,42.58 245.95,43.55 v245.95,44.2
  Bottom 0.254: v245.95,44.2 249.5,44.2 251.15,42.55 251.15,40.68 255.13,36.7 269.86,36.7 271.08,35.48 271.08,31.44 270.51,30.88 U43.2
BT2_5_AIN1_+
  Bottom 0.254: 271.06,24.05 271.06,24.87 270.25,25.68 U43.10 | 271.06,24.05 271.06,23.98 | J48.3 279.85,8.55 281.05,9.75 281.05,11.7 279.75,13 277.23,13 269.39,20.84 268.7,21.52 268.7,22.75 269.35,23.4 270.48,23.4 271.06,23.98 | 271.06,24.05 271.06,23.98
BT2_5_AIN1_-
  Bottom 0.254: U43.11 270.32,25.02 270.65,24.7 270.65,24.15 270.42,23.92 269.22,23.92 268.05,22.75 268.05,21.45 J48.4
BT2_5_AIN2_+
  Bottom 0.254: U43.12 268.7,24.38 | 268.7,24.38 268.38,24.38 | J47.3 274,8.55 275.2,9.75 275.2,13.65 267.4,21.45 267.4,23.4 268.38,24.38 | 268.7,24.38 268.38,24.38
BT2_5_AIN2_-
  Bottom 0.254: U43.13 265.77,24.38 266.75,23.4 266.75,21.45 273.25,14.95 J47.4
BT2_5_MCLK_OUT  (via drill 0.7)
  Top 0.254: v266.1,31.85 v256.35,31.85
  Bottom 0.254: U43.3 267.73,30.23 v266.1,31.85 | v256.35,31.85 256.35,31.2 256.68,30.88 U44.2
BT2_6_AIN1_+
  Bottom 0.254: U44.10 259.93,25.68 269.35,16.25 269.35,9.75 268.15,8.55 J46.3
BT2_6_AIN1_-
  Bottom 0.254: U44.11 259.93,25.02 267.4,17.55 J46.4
BT2_6_AIN2_+
  Bottom 0.254: U44.12 260,24.38 263.5,20.88 263.5,9.75 262.3,8.55 J45.3
BT2_6_AIN2_-
  Bottom 0.254: U44.13 254.72,24.38 261.55,17.55 J45.4
BT2_6_MCLK_OUT  (via drill 0.7)
  Top 0.254: v245.3,31.85 v254.4,31.85
  Bottom 0.254: U44.3 255.38,30.23 254.4,31.2 v254.4,31.85 | U45.2 245.62,30.88 245.3,31.2 v245.3,31.85
BT2_7_AIN1_+
  Bottom 0.254: U45.10 248.88,25.68 257.65,16.9 257.65,9.75 256.45,8.55 J44.3
BT2_7_AIN1_-
  Bottom 0.254: J44.4 255.7,18.2 248.88,25.02 U45.11
BT2_7_AIN2_+
  Bottom 0.254: U45.12 248.88,24.38 251.8,21.45 251.8,9.75 250.6,8.55 J43.3
BT2_7_AIN2_-
  Bottom 0.254: 242.15,24.35 242.14,24.35 242.1,24.35 242.07,24.38 U45.13 243.68,24.38 249.85,18.2 J43.4
BT2_7_MCLK_OUT  (via drill 0.7)
  Top 0.254: v243.35,31.85 v234.25,31.85
  Bottom 0.254: U45.3 244.97,30.23 v243.35,31.85 | v234.25,31.85 234.25,31.2 234.57,30.88 U46.2
BT2_8_AIN1_+
  Bottom 0.254: U46.10 237.82,25.68 245.95,17.55 245.95,9.75 244.75,8.55 J42.3
BT2_8_AIN1_-
  Bottom 0.254: U46.11 237.9,25.02 244,18.93 J42.4
BT2_8_AIN2_+
  Bottom 0.254: U46.12 237.82,24.38 240.1,22.1 240.1,9.75 238.9,8.55 J41.3
BT2_8_AIN2_-
  Bottom 0.254: U46.13 231.97,24.38 238.15,18.2 J41.4
BT_1_AIN1_+
  Top 0.254: U18.10 207.42,116.03 206.19,114.79 206.19,106.6 | 206.19,106.6 206.19,106.31 | 206.19,106.6 206.19,104.53 192.65,91 190.05,91 188.75,89.7 188.75,87.1 189.95,85.9 J49.3
BT_1_AIN1_-
  Top 0.254: 206.79,107.25 206.79,114.59 207.57,115.38 U18.11 | 206.79,107.25 206.79,106.94 | 206.79,107.25 206.79,103.34 J49.4
BT_1_AIN2_+
  Top 0.254: U18.12 207.76,114.72 207.44,114.41 207.44,102.55 195.9,91 194.6,89.7 194.6,87.1 195.8,85.9 J50.3
BT_1_AIN2_-
  Top 0.254: U18.13 210.51,114.72 208.12,112.34 208.12,108.55 208.12,103.35 208.12,101.27 197.2,90.35 J50.4
BT_1_MCLK_OUT  (via drill 0.7)
  Top 0.254: U18.3 211.82,120.58 212.8,121.55 v212.8,122.2 | v221.9,122.2 221.9,121.55 221.57,121.22 U21.2
  Bottom 0.254: v212.8,122.2 v221.9,122.2
BT_2_AIN1_+
  Top 0.254: U21.10 218.58,116.03 217.56,115.01 217.56,104 | 217.56,104 217.56,101.4 217.56,101.19 | J51.3 201.65,85.9 200.45,87.1 200.45,89.7 202.4,91.65 208.25,91.65 217.56,100.96 217.56,104
BT_2_AIN1_-
  Top 0.254: U21.11 218.76,115.38 218.39,115 218.39,100.49 208.9,91 206.15,91 J51.4
BT_2_AIN2_+
  Top 0.254: U21.12 219.71,114.75 219.15,114.75 219.2,114.7 219.2,100 209.55,90.35 206.95,90.35 206.3,89.7 206.3,87.1 207.5,85.9 J52.3
BT_2_AIN2_-
  Top 0.254: U21.13 221.57,114.72 219.96,113.11 219.96,102.7 | 219.96,102.69 219.96,102.7 | J52.4 208.9,88.4 219.96,99.46 219.96,102.7
BT_2_MCLK_OUT  (via drill 0.7)
  Top 0.254: U21.3 222.88,120.58 223.85,121.55 v223.85,122.2 | v232.95,122.2 232.95,121.6 232.57,121.22 U23.2
  Bottom 0.254: v223.85,122.2 v232.95,122.2
BT_3_AIN1_+
  Top 0.254: U23.10 229.38,116.03 220.78,107.43 220.78,98.33 212.15,89.7 212.15,87.1 213.35,85.9 J53.3
BT_3_AIN1_-
  Top 0.254: U23.11 229.38,115.38 227.1,113.1 221.55,107.55 221.55,94.7 J53.4
BT_3_AIN2_+
  Top 0.254: U23.12 229.38,114.72 222.34,107.69 222.34,93.39 218,89.05 218,87.1 219.2,85.9 J54.3
BT_3_AIN2_-
  Top 0.254: U23.13 232.62,114.72 231.65,113.75 229.05,113.75 223.09,107.79 223.09,90.39 J54.4
BT_3_MCLK_OUT  (via drill 0.7)
  Top 0.254: U23.3 233.93,120.58 234.9,121.55 v234.9,122.2 | v244,122.2 244,121.55 243.68,121.22 U24.2
  Bottom 0.254: v234.9,122.2 v244,122.2
BT_4_AIN1_+
  Top 0.254: U24.10 240.43,116.03 238.15,113.75 232.3,113.75 231.65,113.1 229.05,113.1 227.1,111.15 223.85,107.9 223.85,87.1 225.05,85.9 J55.3
BT_4_AIN1_-
  Top 0.254: U24.11 240.43,115.38 238.15,113.1 232.3,113.1 231.65,112.45 229.05,112.45 227.1,110.5 224.58,107.98 224.58,100.67 226.45,98.8 J55.4
BT_4_AIN2_+
  Top 0.254: U24.12 240.43,114.72 238.15,112.45 232.3,112.45 231.65,111.8 229.05,111.8 227.1,109.85 225.35,108.1 225.35,105.95 | 225.35,105.95 225.35,105.75 | J56.3 230.9,85.9 229.7,87.1 229.7,99.45 225.35,103.8 225.35,105.95
BT_4_AIN2_-
  Top 0.254: U24.13 243.68,114.72 242.7,113.75 240.1,113.75 238.15,111.8 232.3,111.8 231.65,111.15 229.05,111.15 227.1,109.2 226,108.11 226,104.44 232.3,98.15 J56.4
BT_4_MCLK_OUT  (via drill 0.7)
  Top 0.254: U24.3 244.97,120.58 245.95,121.55 v245.95,122.2
  Bottom 0.254: v245.95,122.2 249.5,122.2 251.15,120.55 251.15,118.68 255.13,114.7 269.86,114.7 271.08,113.48 271.08,109.44 270.51,108.88 U25.2
BT_5_AIN1_+
  Bottom 0.254: U25.10 270.32,103.67 271.06,102.94 271.06,101.88 270.69,101.51 269.46,101.51 268.7,100.75 268.7,99.45 277.8,90.35 279.75,90.35 281.05,89.05 281.05,87.75 279.2,85.9 J64.3
BT_5_AIN1_-
  Bottom 0.254: J64.4 279.1,88.4 268.05,99.45 268.05,100.75 269.22,101.92 270.52,101.92 270.65,102.05 270.65,102.7 270.32,103.03 U25.11
BT_5_AIN2_+
  Bottom 0.254: J63.3 274,85.9 275.2,87.1 275.2,91.65 267.4,99.45 267.4,101.4 268.38,102.38 U25.12
BT_5_AIN2_-
  Bottom 0.254: U25.13 265.77,102.38 266.75,101.4 266.75,99.45 273.25,92.95 J63.4
BT_5_MCLK_OUT  (via drill 0.7)
  Top 0.254: v266.1,109.85 v256.35,109.85
  Bottom 0.254: U25.3 267.73,108.22 v266.1,109.85 | v256.35,109.85 256.35,109.2 256.68,108.88 U26.2
BT_6_AIN1_+
  Bottom 0.254: J62.3 268.15,85.9 269.35,87.1 269.35,94.25 259.93,103.67 U26.10
BT_6_AIN1_-
  Bottom 0.254: U26.11 259.93,103.03 267.4,95.55 J62.4
BT_6_AIN2_+
  Bottom 0.254: U26.12 259.93,102.38 263.5,98.8 263.5,87.1 262.3,85.9 J61.3
BT_6_AIN2_-
  Bottom 0.254: U26.13 254.07,102.38 261.23,95.22 261.55,94.9 J61.4
BT_6_MCLK_OUT  (via drill 0.7)
  Top 0.254: v245.3,109.85 v254.4,109.85
  Bottom 0.254: U26.3 255.38,108.22 254.4,109.2 v254.4,109.85 | U27.2 245.62,108.88 245.3,109.2 v245.3,109.85
BT_7_AIN1_+
  Bottom 0.254: U27.10 248.88,103.67 257.65,94.9 257.65,87.1 256.45,85.9 J60.3
BT_7_AIN1_-
  Bottom 0.254: U27.11 248.88,103.03 255.7,96.2 J60.4
BT_7_AIN2_+
  Bottom 0.254: U27.12 248.88,102.38 251.8,99.45 251.8,87.1 250.6,85.9 J59.3
BT_7_AIN2_-
  Bottom 0.254: 242.15,102.35 242.14,102.35 242.1,102.35 242.07,102.38 U27.13 243.03,102.38 249.2,96.2 249.85,95.55 J59.4
BT_7_MCLK_OUT  (via drill 0.7)
  Top 0.254: v243.35,109.85 v234.25,109.85
  Bottom 0.254: U27.3 244.97,108.22 v243.35,109.85 | v234.25,109.85 234.25,109.2 234.57,108.88 U28.2
BT_8_AIN1_+
  Bottom 0.254: U28.10 237.75,103.67 245.95,95.47 245.95,87.1 244.75,85.9 J58.3
BT_8_AIN1_-
  Bottom 0.254: U28.11 237.82,103.03 244,96.85 J58.4
BT_8_AIN2_+
  Bottom 0.254: J57.3 238.9,85.9 240.1,87.1 240.1,100.1 237.82,102.38 U28.12
BT_8_AIN2_-
  Bottom 0.254: U28.13 231.97,102.38 238.15,96.2 J57.4
CONVST  (via drill 0.7)
  Top 0.406: U6.2 39.9,118.95 37.5,121.35 37.5,122.2 | 39.9,40.95 U9.2 39.9,40.95 | SV1.16 37.5,141.72 37.5,122.2 | 39.9,40.95 v39.25,41.6 | 37.5,122.2 37.5,121.94
  Bottom 0.406: v39.25,41.6 31.45,49.4 11.75,69.1 11.75,123.3 20.4,131.95 33.4,131.95 37.5,136.05 37.5,139.75 37.5,141.72 SV1.16
DAC1_0
  Top 0.406: U15.34 148.92,33.8 150.82,31.9 U1.15
DAC1_1
  Top 0.406: U15.35 149.14,34.45 153.36,30.23 U1.13
DAC1_2
  Top 0.406: U15.36 149.38,35.1 155.9,28.58 U1.11
DAC1_3
  Top 0.406: U15.37 149.6,35.75 158.44,26.91 U1.9
DAC1_4
  Top 0.406: U15.39 149.18,37.05 160.98,25.25 U1.7
DAC1_5
  Top 0.406: U15.40 132.85,39.49 133.66,40.3 146.82,40.3 162.26,24.86 | 162.65,24.47 162.26,24.86 | U1.5 163.52,23.6 162.26,24.86
DAC1_6
  Top 0.406: U15.41 132.2,39.78 133.37,40.95 147.04,40.95 164.97,23.02 | 164.97,23.02 165.2,22.79 | U1.3 166.06,21.93 164.97,23.02
DAC1_7
  Top 0.406: U15.42 131.55,39.92 133.13,41.51 147.27,41.51 168.6,20.18 U1.1
DAC1_8
  Top 0.406: U15.15 125.7,24.45 130.5,19.65 U1.31
DAC1_9
  Top 0.406: U15.16 126.35,24.73 133.04,18.04 U1.29
DAC1_10
  Top 0.406: U15.17 127,25 135.58,16.42 U1.27
DAC1_11
  Top 0.406: U15.18 127.65,25.25 138.12,14.78 U1.25
DAC1_12
  Top 0.406: U15.20 128.95,25.72 140.66,14.01 U1.23
DAC1_13
  Top 0.406: U15.21 129.6,26.04 143.2,12.44 U1.21
DAC1_14
  Top 0.406: U15.22 130.25,26.34 145.74,10.85 U1.19
DAC1_15
  Top 0.406: U15.23 130.9,26.62 143.87,13.65 144.97,13.65 U1.17
DAC2_0
  Top 0.406: U19.34 148.27,112.45 151.47,109.25 U2.15
DAC2_1
  Top 0.406: U19.35 148.49,113.1 154.01,107.58 U2.13
DAC2_2
  Top 0.406: U19.36 148.73,113.75 156.55,105.93 U2.11
DAC2_3
  Top 0.406: U19.37 148.95,114.4 159.09,104.26 U2.9
DAC2_4
  Top 0.406: U19.39 148.53,115.7 161.63,102.6 U2.7
DAC2_5
  Top 0.406: U19.40 132.2,118.14 133.01,118.95 146.17,118.95 164.17,100.95 U2.5
DAC2_6
  Top 0.406: U19.41 131.55,118.43 132.72,119.6 146.39,119.6 166.71,99.28 U2.3
DAC2_7
  Top 0.406: U19.42 130.9,118.69 132.46,120.25 146.65,120.25 169.25,97.65 U2.1
DAC2_8
  Top 0.406: U19.15 125.05,103.1 131.15,97 U2.31
DAC2_9
  Top 0.406: U19.16 125.7,103.38 133.69,95.39 U2.29
DAC2_10
  Top 0.406: U19.17 126.35,103.65 136.23,93.77 U2.27
DAC2_11
  Top 0.406: U19.18 127,103.9 138.77,92.13 U2.25
DAC2_12
  Top 0.406: U19.20 128.3,104.37 141.31,91.36 U2.23
DAC2_13
  Top 0.406: U19.21 128.95,104.69 143.85,89.79 U2.21
DAC2_14
  Top 0.406: U19.22 129.6,104.99 146.39,88.2 U2.19
DAC2_15
  Top 0.406: U19.23 130.25,105.27 131.92,103.6 144.52,91 145.62,91 U2.17
DVCC  (via drill 0.7)
  Top 0.254: C11.2 Y3.4 | 227.1,125.9 218.8,125.9 | 218.8,125.9 216.05,125.9 | 227.1,125.9 227.1,121.95 226.37,121.22 U21.23 225.34,121.2 224.15,121.2 221.57,118.62 | v258.45,121.05 C13.1 C14.1 263.36,121.04 v264.94,121.04 | U18.5 U18.6 210.53,118.62 | 210.53,118.62 213.12,121.22 U18.23 215.32,121.22 216.05,121.95 216.05,125.9 | 221.57,118.62 U21.6 U21.5 | 232.62,118.62 U23.6 U23.5 | 232.62,118.62 235.22,121.22 U23.23 237.39,121.22 238.15,121.98 238.15,125.9 | 227.1,125.9 238.15,125.9 | 238.15,125.9 249.15,125.9 249.2,125.85 | 243.68,118.62 U24.6 U24.5 | 243.68,118.62 246.28,121.22 U24.23 248.47,121.22 249.2,121.95 249.2,125.85 | 216.05,125.9 205.45,125.9 203.7,124.15 C11.2 | C15.1 v256.45,129.35 253.75,129.35 253.1,130 250.5,130 249.2,128.7 249.2,125.85 | C11.2 201.6,123.35 186.15,107.9 v186.15,78 | C20.1 218.85,125.95 218.8,125.9 | U24.18 246.28,117.97 245.95,117.65 244.65,117.65 243.68,118.62 | U23.18 235.22,117.97 234.9,117.65 233.6,117.65 232.62,118.62 | U21.18 224.18,117.97 223.85,117.65 222.55,117.65 221.57,118.62 | U18.18 213.12,117.97 212.8,117.65 211.5,117.65 210.53,118.62 | C52.2 Y7.4 | 227.1,47.9 218.8,47.9 | 218.8,47.9 216.05,47.9 | 227.1,47.9 227.1,43.95 226.37,43.23 U39.23 225.34,43.2 224.15,43.2 221.57,40.62 | v258.45,43.05 C54.1 C55.1 263.36,43.04 v264.94,43.04 | U38.5 U38.6 210.53,40.62 | 210.53,40.62 213.12,43.23 U38.23 215.32,43.23 216.05,43.95 216.05,47.9 | 221.57,40.62 U39.6 U39.5 | 232.62,40.62 U41.6 U41.5 | 232.62,40.62 235.22,43.23 U41.23 237.39,43.23 238.15,43.98 238.15,47.9 | 227.1,47.9 238.15,47.9 | 238.15,47.9 249.15,47.9 249.2,47.85 | 243.68,40.62 U42.6 U42.5 | 243.68,40.62 246.28,43.23 U42.23 248.47,43.23 249.2,43.95 249.2,47.85
  Top 0.254: 216.05,47.9 205.45,47.9 205,47.45 203.7,46.15 C52.2 | C56.1 v256.45,51.35 253.75,51.35 253.1,52 250.5,52 249.2,50.7 249.2,47.85 | C61.1 218.85,47.95 218.8,47.9 | U42.18 246.28,39.98 245.95,39.65 244.65,39.65 243.68,40.62 | U41.18 235.22,39.98 234.9,39.65 233.6,39.65 232.62,40.62 | U39.18 224.18,39.98 223.85,39.65 222.55,39.65 221.57,40.62 | U38.18 213.12,39.98 212.8,39.65 211.5,39.65 210.53,40.62 | C52.2 202.55,45.35 192,55.9 v192,61.1
  Top 0.406: U15.44 130.25,37.7 129.6,37.05 127,37.05 126.35,37.7 U15.50 126.35,42.75 125.95,43.15 C102.1 | U15.44 130.25,39.65 | C102.1 125.2,42.85 | U15.44 130.25,40.5 132.4,42.65 C103.1 C2.+ | C102.1 119.15,43.15 118.85,42.85 R16.1 | R16.1 118.85,40.7 R15.1 | U19.44 129.6,116.35 128.95,115.7 126.35,115.7 125.7,116.35 U19.50 125.7,121.4 125.3,121.8 C136.1 | U19.44 129.6,118.3 | C136.1 124.55,121.5 | U19.44 129.6,119.15 131.75,121.3 C137.1 C22.+ | C136.1 118.5,121.8 118.2,121.5 R20.1 118.2,119.35 | 118.16,119.39 118.2,119.35 | 118.2,119.35 R19.1 | U5.49 | U5.49 58.42,121.83 59.24,122.65 C47.1 C46.1 69.65,122.65 | 69.65,122.65 69.95,122.35 | 69.95,122.35 71.95,120.34 R2.2 R4.2 | v58.4,117.45 58.42,117.47 U5.49 | U6.5 v44.44,119.61 v44.45,119.6 | U8.49 | U8.49 58.42,43.83 59.24,44.65 C78.1 C77.1 69.65,44.65 | 69.65,44.65 69.95,44.35 | 69.95,44.35 71.95,42.34 R7.2 R8.2 | v58.4,39.45 58.42,39.48 U8.49 | U9.5 v44.44,41.61 v44.45,41.6 | 69.65,44.65 69.95,44.35 | 69.65,122.65 69.95,122.35 | 118.2,119.35 113.1,119.35 107.75,114 107.75,81.25 105.8,79.3 104.9,79.3 v103.6,78 | v35.7,39.45 35.7,67.9 37.3,68.25 | R3.2 290.15,94.25 v285.6,89.7 | v113.35,60.45 113.35,44.2 115.65,41.9 R16.1 | C102.1 C1.+ | C136.1 C21.+
  Top 2.54: v31.45,68.25 37.3,68.25 v103.6,68.25 v113.35,68.25 v186.15,68.25 v192,68.25 283.65,68.25 292.1,59.8 292.1,35.75 293.8,34.05 | PL1.2 293.8,34.05 | 293.8,34.05 292.75,35.1
  Bottom 0.254: 265.96,127.91 U22.48 256.45,127.94 v256.45,129.35 | 265.96,127.91 U22.1 270,127.91 | U22.64 265.96,127.91 | U22.32 v258.44,121.04 v258.45,121.05 | SV10.1 271.27,131.27 270,130 270,127.91 | U26.6 256.35,106.28 | U26.5 U26.6 | U26.6 260.57,106.28 261.55,105.3 262.65,105.3 262.98,105.62 U25.18 266.4,105.62 266.95,106.17 | U27.5 U27.6 | U28.5 U28.6 | U27.6 249.53,106.28 250.5,105.3 251.65,105.3 251.97,105.62 U26.18 254.07,105.62 254.4,105.3 254.4,104.2 254.97,103.63 255.83,103.63 256.35,104.15 256.35,106.28 | U28.6 238.47,106.28 239.45,105.3 240.55,105.3 240.88,105.62 U27.18 242.74,105.62 243.03,105.34 243.03,104.33 243.35,104 244.4,104 245.12,104.72 245.12,106.28 | U28.6 234.07,106.28 | U27.6 245.12,106.28 | U28.18 231.65,105.62 231.97,105.3 231.97,104.97 232.66,104.29 233.42,104.29 234.07,104.94 234.07,106.28 | 270,127.91 C16.1 271.9,125.95 272.6,125.25 272.6,121.85 272,121.25 C12.2 270.5,121.25 269.86,121.89 U22.13 265.79,121.89 v264.94,121.04 U22.19 264.94,116.86 265.45,116.35 268.7,116.35 269.03,116.68 269.76,116.68 271.57,114.87 271.57,107.9 270.6,106.92 U25.5 U25.6 267.05,106.28 266.95,106.17 | C19.1 251.15,109.55 251.82,108.88 U26.23 254.07,108.88 256.35,106.6 256.35,106.28 | U25.23 265.77,108.88 266.95,107.7 266.95,106.17 | U27.23 243.03,108.88 245.12,106.78 245.12,106.28 | U28.23 231.97,108.88 234.07,106.78 234.07,106.28 | 265.96,49.91 U40.48 256.45,49.94 v256.45,51.35 | 265.96,49.91 U40.1 270,49.91 | U40.64 265.96,49.91 | U40.32 v258.44,43.04 v258.45,43.05 | SV21.1 271.27,53.27 270,52 270,49.91 | U44.6 256.35,28.27 | U44.5 U44.6 | U44.6 260.57,28.27 261.55,27.3 262.65,27.3 262.98,27.62 U43.18 266.4,27.62 266.95,28.18
  Bottom 0.254: U45.5 U45.6 | U46.5 U46.6 | U45.6 249.53,28.27 250.5,27.3 251.65,27.3 251.97,27.62 U44.18 254.07,27.62 254.4,27.3 254.4,26.2 254.97,25.63 255.83,25.63 256.35,26.15 256.35,28.27 | U46.6 238.47,28.27 239.45,27.3 240.55,27.3 240.88,27.62 U45.18 242.74,27.62 243.03,27.34 243.03,26.32 243.35,26 244.4,26 245.12,26.73 245.12,28.27 | U46.6 234.07,28.27 | U45.6 245.12,28.27 | U46.18 231.65,27.62 231.97,27.3 231.97,26.98 232.66,26.29 233.42,26.29 234.07,26.94 234.07,28.27 | 270,49.91 C57.1 271.9,47.95 272.6,47.25 272.6,43.85 272,43.25 C53.2 270.5,43.25 269.86,43.89 U40.13 265.79,43.89 v264.94,43.04 U40.19 264.94,38.86 265.45,38.35 268.7,38.35 269.03,38.68 269.76,38.68 271.57,36.87 271.57,29.9 270.6,28.93 U43.5 U43.6 267.05,28.27 266.95,28.18 | C60.1 251.15,31.55 251.82,30.88 U44.23 254.07,30.88 256.35,28.6 256.35,28.27 | U43.23 265.77,30.88 266.95,29.7 266.95,28.18 | U45.23 243.03,30.88 245.12,28.77 245.12,28.27 | 234.07,28.27 234.07,28.77 231.97,30.88 U46.23 | v192,61.1 v192,68.25 | v186.15,78 v186.15,68.25
  Bottom 0.406: v58.4,117.45 44.45,117.45 | v44.45,119.6 44.45,117.45 | v58.4,39.45 44.45,39.45 | 44.45,39.45 v35.7,39.45 | v44.45,41.6 44.45,39.45 | 44.45,117.45 37.1,117.45 31.45,111.8 v31.45,68.25 | v113.35,60.45 v113.35,68.25 | v103.6,78 v103.6,68.25 | v285.6,89.7 285.6,40.3 291.85,34.05 PL1.2
GND  (via drill 0.7)
  other vias: 138.4,49.4 117.9,51.35 117.9,44.85 147.15,44.85 147.15,31.2 147.15,24.7 123.1,24.7 138.4,44.85 138.4,38.65 137.75,128.05 146.5,123.5 146.5,109.85 146.5,103.35 122.45,104 137.75,123.5 137.75,117.3 214.75,124.8 217.35,124.8 225.8,124.8 228.4,124.8 236.85,124.8 239.45,124.8 247.9,124.8 249.45,113.1 258.5,113.1 246.85,113.1 255.9,113.1 266.15,120.3 264.15,132.6 265.45,132.6 266.75,132.6 212.8,124.8 210.85,124.8 223.85,124.8 221.9,124.8 245.95,124.8 244,124.8 215.4,128.05 220.6,128.05 222.55,128.05 234.9,124.8 232.95,124.8 253.3,113.1 261.1,113.1 242.95,112.45 241,112.45 232.55,110.5 229.05,109.85 216.05,116.35 227.1,116.35 238.15,116.35 206.95,122.85 258.3,122.8 261.55,125.9 261.5,123.85 267.4,117.4 229.05,104.65 267.9,107.25 267.9,109.85 239.85,104.2 250.95,104 208.9,124.8 216.05,113.1 225.15,113.1 221.9,109.85 253.75,133.9 256.35,134.55 217.35,117.65 267.9,105.3 214.75,46.8 217.35,46.8 225.8,46.8 228.4,46.8 236.85,46.8 239.45,46.8 247.9,46.8 249.45,35.1 258.5,35.1 246.85,35.1 255.9,35.1 266.15,42.3 264.15,54.6 265.45,54.6 266.75,54.6 212.8,46.8 210.85,46.8 223.85,46.8 221.9,46.8 245.95,46.8 244,46.8 215.4,50.05 222.55,50.05 234.9,46.8 232.95,46.8 253.3,35.1 261.1,35.1 242.95,34.45 241,34.45 232.55,32.5 229.05,31.85 216.05,38.35 227.1,38.35 238.15,38.35 206.95,46.8 206.95,44.85 258.3,44.8 261.55,47.9 261.5,45.85 267.4,39.4 229.05,26.65 267.9,29.25 267.9,31.85 239.85,26.2 250.95,26 208.9,46.8 216.05,35.1 225.15,35.1 213.45,31.85 221.9,31.85 253.75,56.55 256.35,56.55 217.35,39.65 267.9,27.3 62.65,115.7 62.65,117.65 56.15,115.7 59.4,115.7 36,121.55 36,114.4 36.65,109.2 30.8,114.4 62.65,37.7 62.65,39.65 56.15,37.7 59.4,37.7 36.65,37.05 36.65,31.2 32.1,31.2 140.35,117.3 142.95,117.3 131.25,112.1 129.3,112.1 126.05,108.2 128,108.2 141,38.65 143.6,38.65 129.95,33.45 131.9,33.45 126.7,29.55 128.65,29.55 122.45,105.95 123.1,26.65 113.05,116.65 109.8,114.05 109.8,109.5 113.05,112.75 114,41.6 114,38.35 145.55,117.3 146.2,38.65 110.45,105.6 113.7,108.85 124.75,111.45 125.4,32.8 220.6,50.05 213.45,50.05 213.45,128.05 213.45,110.5 199.8,115.7 196.55,113.1 193.3,110.5 190.05,107.9 200.45,105.95 197.2,102.7 193.95,99.45 190.7,96.2 210.85,107.9 210.85,102.05 210.2,28.6 210.2,24.7 171.85,146.9 171.85,144.3 183.55,144.3 183.55,146.9
  pour Top (isolate 0.254): -3,-1.95 -3,153 310.95,153 310.95,-1.95
  pour Bottom (isolate 0.254): -5.6,-3.25 -5.6,155 312.9,155 312.9,-3.25
HEARTBEAT
  Top 0.406: SV1.3 23.51,137.66 22.35,136.5 R11.2
LC_1_MCLK
  Top 0.254: U18.2 205.57,121.22 Y3.3
LC_1_NRST  (via drill 0.7)
  Top 0.254: SV10.4 263.09,135.85 260.1,132.86 v260.1,124.9
  Bottom 0.254: v260.1,124.9 265.96,124.91 U22.7
LC_1_RDY1  (via drill 0.7)
  Top 0.254: U18.20 212.78,119.28 v212.15,118.65 | v250.15,115.35 250.15,116 251.65,117.5 251.65,118.15 254.57,121.08 254.57,125.88 v252.4,128.05
  Bottom 0.254: v212.15,118.65 221.55,118.65 222.55,117.65 231.85,117.65 232.2,117.3 241.95,117.3 242.9,116.35 248.65,116.35 249.65,115.35 v250.15,115.35 | U22.44 255.3,125.9 253.15,128.05 v252.4,128.05
LC_1_RDY2  (via drill 0.7)
  Top 0.254: U21.20 223.82,119.28 v223.2,118.65 | v251.45,115.4 251.45,116.65 252.2,117.4 252.2,118.05 255.15,121 255.15,123.5 | 255.15,123.5 255.15,123.74 | 255.15,123.5 255.15,124.25 256.55,125.65 v258.3,125.65
  Bottom 0.254: v223.2,118.65 231.95,118.65 232.85,117.75 242.75,117.75 243.5,117 248.7,117 249.35,116.35 250.5,116.35 v251.45,115.4 | v258.3,125.65 258.04,125.39 U22.43
LC_1_RDY3  (via drill 0.7)
  Top 0.254: U23.20 234.88,119.28 v234.25,118.65 | v252.75,115.4 252.75,117.95 255.7,120.9 255.7,123.5 256.5,124.3 v258.3,124.3
  Bottom 0.254: v234.25,118.65 243,118.65 244,117.65 248.75,117.65 249.6,116.8 250.7,116.8 251.15,116.35 251.8,116.35 v252.75,115.4 | U22.42 257.69,124.91 v258.3,124.3
LC_1_RDY4  (via drill 0.7)
  Top 0.254: U24.20 245.93,119.28 v245.3,118.65 | v250.15,117.7 250.55,117.7 254,121.15 254,125.05 253.6,125.45 251.15,127.9 v251.15,129
  Bottom 0.254: v245.3,118.65 249.2,118.65 v250.15,117.7 | U22.45 255.39,126.41 252.8,129 v251.15,129
LC_1_RDY5  (via drill 0.7)
  Top 0.254: v265.9,106.9 265.9,103.35 268.75,100.5 v270.15,100.5
  Bottom 0.254: U25.20 265.88,106.92 v265.9,106.9 | v270.15,100.5 271.7,100.5 272.09,100.89 272.09,115.14 268.79,118.44 U22.17
LC_1_RDY6  (via drill 0.7)
  Top 0.254: v273.25,98.8 272.1,97.65 262.3,97.65 v255.4,104.55
  Bottom 0.254: U26.20 254.42,106.92 255.4,105.94 v255.4,104.55 | U22.16 267.92,119.89 273.25,114.55 v273.25,98.8
LC_1_RDY7  (via drill 0.7)
  Top 0.254: v244,104.9 244,102.7 245.3,101.4 257.65,101.4 260.9,98.15 | 260.9,98.15 261.2,97.85 | 260.9,98.15 261.9,97.15 272.9,97.15 274.2,98.45 v274.2,99.8
  Bottom 0.254: U27.20 243.27,106.92 244,106.2 v244,104.9 | U22.15 268.95,120.9 269.4,120.45 269.4,118.97 274.2,114.17 v274.2,99.8
LC_1_RDY8  (via drill 0.7)
  Top 0.254: v233.1,105.3 233.1,105.15 237.5,100.75 257.5,100.75 261.6,96.65 273.7,96.65 275.05,98 v275.05,98.8
  Bottom 0.254: v233.1,105.3 233.1,106.02 232.2,106.92 U28.20 | U22.14 269.19,121.41 270,120.6 270,118.95 275.05,113.9 275.05,100.77 275.05,100.76 v275.05,98.8
LC_1_SPI1_MISO  (via drill 0.7)
  Top 0.254: U18.21 215.32,119.92 215.65,119.6 v216.95,119.6 | v228,119.6 226.7,119.6 226.38,119.92 U21.21 | v239.05,119.6 237.75,119.6 237.43,119.92 U23.21 | U24.21 248.47,119.92 248.8,119.6 v250.15,119.6 251.8,121.25 v251.8,122.55 | v260.9,107.25 v249.85,107.25 v238.8,107.25 v227.75,107.25 | v255.7,116.7 261.85,116.7 v265.45,113.1